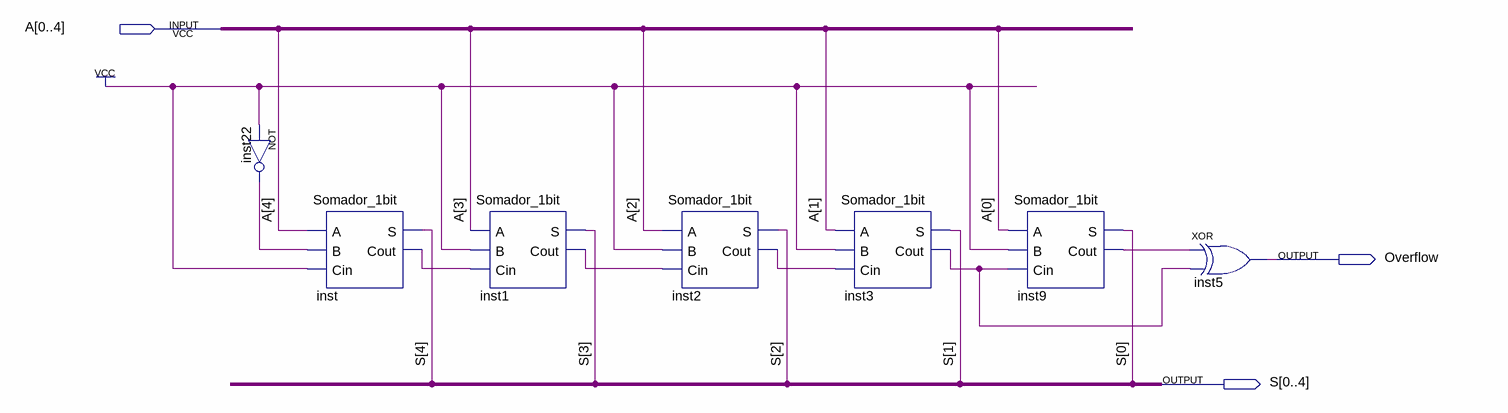
[diagram p0: schematic sheet]
// Quartus schematic A-1.bdf as structural Verilog: 7 symbols, 3 pins
module \A-1  (
  input  [0:4] A,
  output Overflow,
  output [0:4] S
);

  wire inst1_cout, inst2_cout, inst3_cout, inst9_cout, inst22_out, inst_cout;

  not inst22 (inst22_out, 1'b1);
  Somador_1bit inst (.A(A[4]), .B(inst22_out), .Cin(1'b1), .S(S[4]), .Cout(inst_cout));
  Somador_1bit inst1 (.A(A[3]), .B(1'b1), .Cin(inst_cout), .S(S[3]), .Cout(inst1_cout));
  Somador_1bit inst2 (.A(A[2]), .B(1'b1), .Cin(inst1_cout), .S(S[2]), .Cout(inst2_cout));
  Somador_1bit inst3 (.A(A[1]), .B(1'b1), .Cin(inst2_cout), .S(S[1]), .Cout(inst3_cout));
  Somador_1bit inst9 (.A(A[0]), .B(1'b1), .Cin(inst3_cout), .S(S[0]), .Cout(inst9_cout));
  xor inst5 (Overflow, inst9_cout, inst3_cout);
endmodule
